# EAGLE schematic STM8S003 (EAGLE 6.5.0)
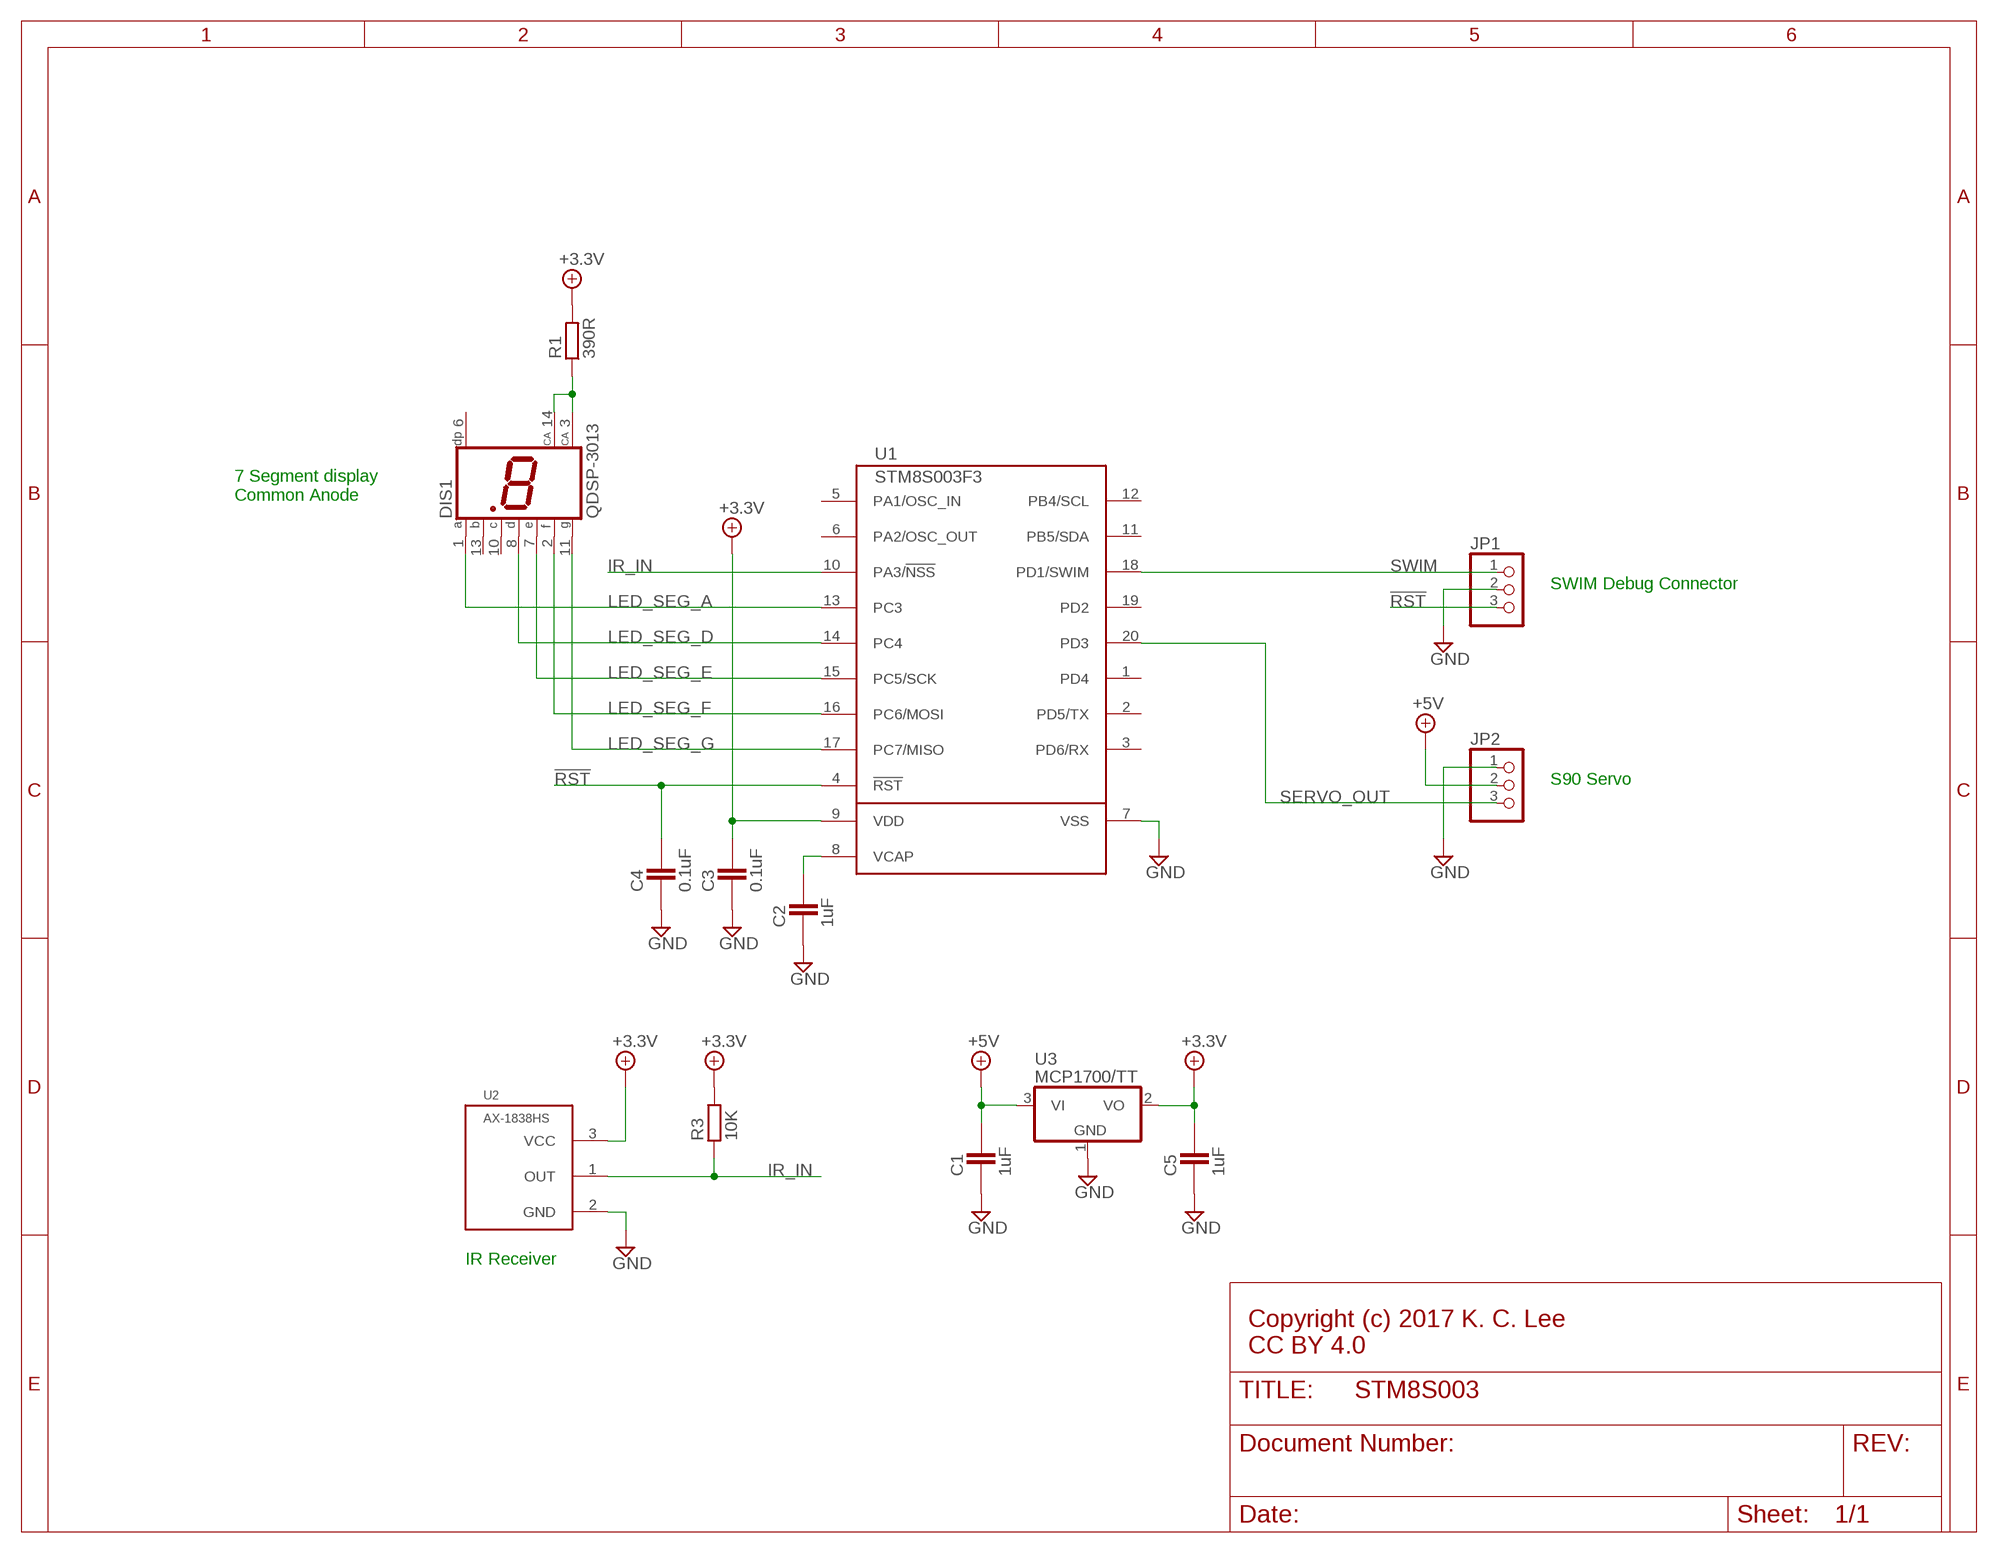
[diagram p0: schematic, sheet 1]

## Parts
C1  1uF  CAPACITOR_0603  [CAPC1608X92N]
C2  1uF  CAPACITOR_0603  [CAPC1608X92N]
C3  0.1uF  CAPACITOR_0603  [CAPC1608X92N]
C4  0.1uF  CAPACITOR_0603  [CAPC1608X92N]
C5  1uF  CAPACITOR_0603  [CAPC1608X92N]
DIS1  QDSP-3013  [QDSP-3013]
JP1  PINHD-1X3  [1X03]
JP2  PINHD-1X3  [1X03]
R1  390R  RESISTOR_0603  [RESC1608X55N]
R3  10K  RESISTOR_0603  [RESC1608X55N]
U1  STM8S003F3  STM8SX03F3  [TSSOP20]
U2  AX-1838HS  [AX1838]
U3  MCP1700/TT  [SOT95P280X135-3N]

## Nets
!RST: C4.2 JP1.3 U1.4(!RST)
+3.3V: C3.2 C5.2 R1.2 R3.2 U1.9(VDD) U2.3(VCC) U3.2(VO)
+5V: C1.2 JP2.2 U3.3(VI)
GND: C1.1 C2.1 C3.1 C4.1 C5.1 JP1.2 JP2.1 U1.7(VSS) U2.2(GND) U3.1(GND)
IR_IN: R3.1 U1.10(PA3/!NSS) U2.1(OUT)
LED_SEG_A: DIS1.1(A) U1.13(PC3)
LED_SEG_D: DIS1.8(D) U1.14(PC4)
LED_SEG_E: DIS1.7(E) U1.15(PC5/SCK)
LED_SEG_F: DIS1.2(F) U1.16(PC6/MOSI)
LED_SEG_G: DIS1.11(G) U1.17(PC7/MISO)
N$1: C2.2 U1.8(VCAP)
N$2: DIS1.3(CA) DIS1.14(CA) R1.1
SERVO_OUT: JP2.3 U1.20(PD3)
SWIM: JP1.1 U1.18(PD1/SWIM)
Unconnected: DIS1.6(DP) DIS1.10(C) DIS1.13(B) U1.1(PD4) U1.2(PD5/TX) U1.3(PD6/RX) U1.5(PA1/OSC_IN) U1.6(PA2/OSC_OUT) U1.11(PB5/SDA) U1.12(PB4/SCL) U1.19(PD2)

## Notes on the sheet
- 7 Segment display
  Common Anode
- SWIM Debug Connector
- S90 Servo
- IR Receiver
- Copyright (c) 2017 K. C. Lee
  CC BY 4.0

## Library data of the parts
C1-C5 = ipc-7351-capacitor:CAPACITOR_
DIS1 = Misc opto:QDSP-3013: LED DISPLAY 1-character 7 segment, decimal point right
JP1 JP2 = Misc Conn:PINHD-1X3: PIN HEADER
R1 R3 = ipc-7351-resistor:RESISTOR_
U1 = Misc Processor:STM8SX03F
U2 = Misc opto:AX-1838
U3 = Misc Power:MCP1700